# Altium schematic sheet RF.SchDoc
size A
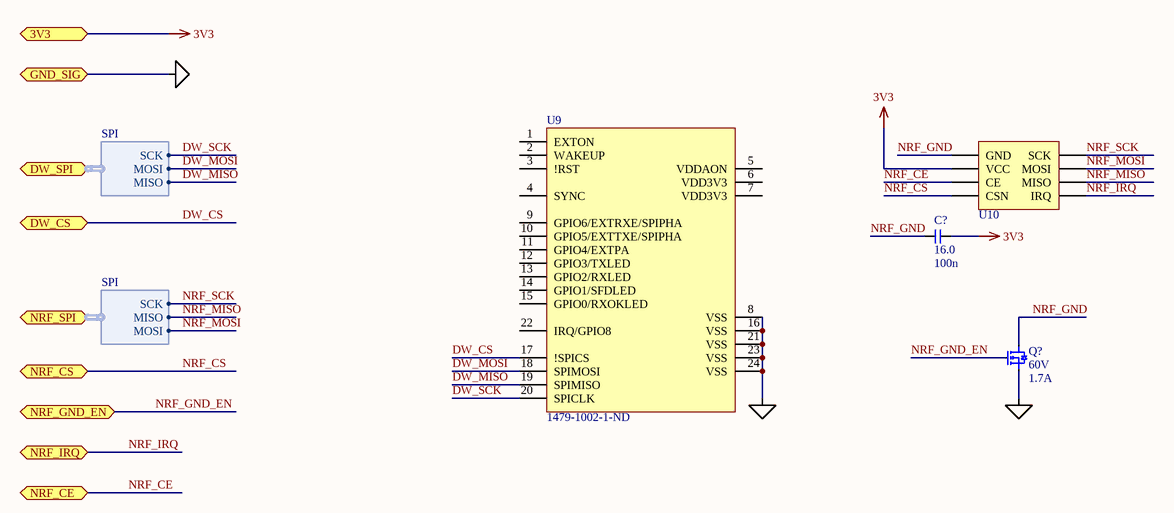
[diagram p0: RF.SchDoc]

## Parts
C?  voltage: 16.0  human_value: 100n  [C0603]  (hidden comment: __template_cap)
Q?  Drain to Source Voltage (Vdss): 60V  Current - Continuous Drain (Id) @ 25° C: 1.7A  [3SOT23]  (hidden comment: MOSFET N-CH 60V 1.7A SSOT3)
U9  Supplier Part Number 1: 1479-1002-1-ND  [decawave_DWM1000]  (hidden comment: DECAWAVE_DWM1000)
U10  SEEEDSTUDIO_nRF24L01+  [SEEEDSTUDIO_nRF24L01]  (value not drawn)

## Ports
3V3, DW_CS, DW_SPI (harness SPI), GND_SIG, NRF_CE, NRF_CS, NRF_GND_EN, NRF_IRQ, NRF_SPI (harness SPI)

## Harnesses
SPI: MISO, MOSI, SCK

## Nets
3V3: C?.1 U10.2(VCC) ; port 3V3
GDNSIG: Q?.2 U9.8(VSS) U9.16(VSS) U9.21(VSS) U9.23(VSS) U9.24(VSS) ; port GND_SIG
DW_CS: U9.17(!SPICS) ; port DW_CS
DW_MISO: U9.19(SPIMISO) ; port DW_SPI.MISO
DW_MOSI: U9.18(SPIMOSI) ; port DW_SPI.MOSI
DW_SCK: U9.20(SPICLK) ; port DW_SPI.SCK
NRF_CE: U10.3(CE) ; port NRF_CE
NRF_CS: U10.4(CSN) ; port NRF_CS
NRF_GND: C?.2 Q?.3 U10.1(GND)
NRF_GND_EN: Q?.1 ; port NRF_GND_EN
NRF_IRQ: U10.8(IRQ) ; port NRF_IRQ
NRF_MISO: U10.7(MISO) ; port NRF_SPI.MISO
NRF_MOSI: U10.6(MOSI) ; port NRF_SPI.MOSI
NRF_SCK: U10.5(SCK) ; port NRF_SPI.SCK

Not connected (* = marked no-connect by the designer): U9 1(EXTON) 2(WAKEUP) 3(!RST) 4(SYNC) 5(VDDAON) 6(VDD3V3) 7(VDD3V3) 9(GPIO6/EXTRXE/SPIPHA) 10(GPIO5/EXTTXE/SPIPHA) 11(GPIO4/EXTPA) 12(GPIO3/TXLED) 13(GPIO2/RXLED) 14(GPIO1/SFDLED) 15(GPIO0/RXOKLED) 22(IRQ/GPIO8)

## Library data of the parts
C? = 478-3726-1-ND: type: capacitor; value: 1e-07; description: CAP CER 0.1UF 16V 5% X7R 0603; tolerance: 5%; Supplier Part Number 1: 478-3726-1-ND; package: 0603; price: 0.374
Q? = NFET_FDN5630: Manufacturer: Fairchild Semiconductor; FET Type: MOSFET N-Channel, Metal Oxide; FET Feature: Logic Level Gate; Rds On (Max) @ Id, Vgs: 100 mOhm @ 1.7A, 10V; Vgs(th) (Max) @ Id: 3V @ 250µA; Gate Charge (Qg) @ Vgs: 10nC @ 10V; Input Capacitance (Ciss) @ Vds: 400pF @ 15V; Power - Max: 460mW; Supplier 1: Digi-Key; Manufacturer Part Number: FDN5630; RoHS: RoHS Compliant; Category: Discrete Semiconductor Products; Stock 1: 136076; Pricing 1: 1=0.66, 10=0.532, 100=0.3986, 250=0.34428, 500=0.29596, 1000=0.22952 (USD); Mounting Type: Surface Mount; Package / Case: TO-236-3, SC-59, SOT-23-3; Supplier Device Package: 3-SSOT; Packaging: Cut Tape (CT); ComponentLink1URL: http://www.fairchildsemi.com/ds/FD/FDN5630.pdf; ComponentLink1Description: http://www.fairchildsemi.com/ds/FD/FDN5630.pdf; Supplier Part Number 1: FDN5630CT-ND
U9 = DECAWAVE_DWM1000: RF TXRX MODULE 802.15.4 CHIP ANT; Manufacturer: Decawave Limited; Protocol: IR-UWB; Modulation: BPM, BPSK; Frequency: 3.5GHz ~ 6.5GHz; Data Rate: 6.8Mbps; Serial Interfaces: SPI; Antenna Type: Integrated, Chip; Voltage - Supply: 2.8 V ~ 3.6 V; Current - Receiving: 64mA; Current - Transmitting: 31mA; Supplier 1: Digi-Key; Manufacturer Part Number: DWM1000; RoHS: RoHS Compliant; Category: RF/IF and RFID; Stock 1: 6649; Pricing 1: 1=25.59, 10=23.625, 25=21.6564, 100=20.0156, 250=19.03124 (USD); Packaging: Cut Tape (CT); RF Family/Standard: 802.15.4; Power - Output: -; Sensitivity: -; Memory Size: -; Mounting Type: Surface Mount; Operating Temperature: -40°C ~ 85°C; Package / Case: Module; ComponentLink1URL: http://www.decawave.com/sites/default/files/resources/dwm1000-datasheet-v1.3.pdf; ComponentLink1Description: http://www.decawave.com/sites/default/files/resources/dwm1000-datasheet-v1.3.pdf
U10 = SEEEDSTUDIO_nRF24L01+: RF24L01 ULP 2Mbps RF transceiver 2.4GHz ISM